# EAGLE design 555re4 (EAGLE 6.3)
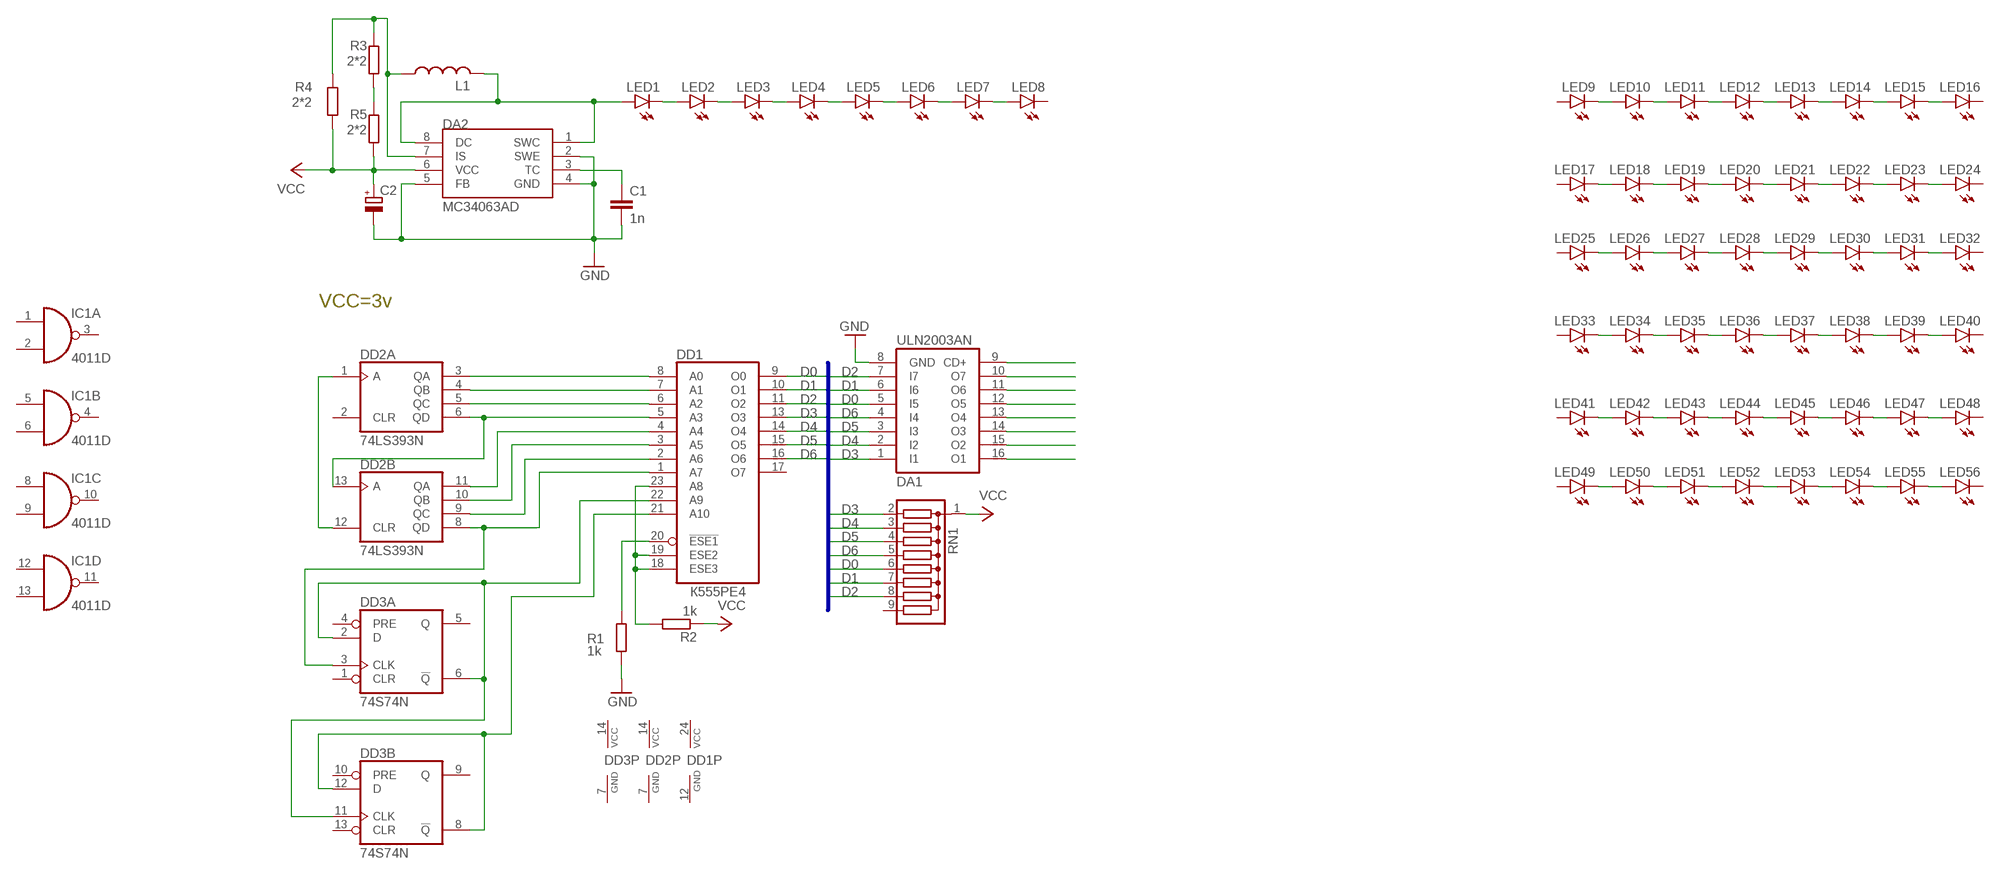
[diagram p0: schematic, sheet 1]

## Parts
C1  1n  C-EU050-025X075  [C050-025X075]
C2  CPOL-EUE2-5  [E2-5]
DA1  ULN2003AN  [DIL16]
DA2  MC34063AD  [SOIC8]
DD1  K555RE4  [239.24-2]
DD2  74LS393N  [DIL14]
DD3  74S74N  [DIL14]
IC1  4011D  [SO14]
L1  L-USTJ3-U2  [TJ3-U2]
LED1  LED3MM  [LED3MM]
LED2  LED3MM  [LED3MM]
LED3  LED3MM  [LED3MM]
LED4  LED3MM  [LED3MM]
LED5  LED3MM  [LED3MM]
LED6  LED3MM  [LED3MM]
LED7  LED3MM  [LED3MM]
LED8  LED3MM  [LED3MM]
LED9  LED3MM  [LED3MM]
LED10  LED3MM  [LED3MM]
LED11  LED3MM  [LED3MM]
LED12  LED3MM  [LED3MM]
LED13  LED3MM  [LED3MM]
LED14  LED3MM  [LED3MM]
LED15  LED3MM  [LED3MM]
LED16  LED3MM  [LED3MM]
LED17  LED3MM  [LED3MM]
LED18  LED3MM  [LED3MM]
LED19  LED3MM  [LED3MM]
LED20  LED3MM  [LED3MM]
LED21  LED3MM  [LED3MM]
LED22  LED3MM  [LED3MM]
LED23  LED3MM  [LED3MM]
LED24  LED3MM  [LED3MM]
LED25  LED3MM  [LED3MM]
LED26  LED-3MM-NO_SILK  [LED3MM-NS]
LED27  LED3MM  [LED3MM]
LED28  LED3MM  [LED3MM]
LED29  LED3MM  [LED3MM]
LED30  LED3MM  [LED3MM]
LED31  LED3MM  [LED3MM]
LED32  LED3MM  [LED3MM]
LED33  LED3MM  [LED3MM]
LED34  LED3MM  [LED3MM]
LED35  LED3MM  [LED3MM]
LED36  LED3MM  [LED3MM]
LED37  LED3MM  [LED3MM]
LED38  LED3MM  [LED3MM]
LED39  LED3MM  [LED3MM]
LED40  LED3MM  [LED3MM]
LED41  LED3MM  [LED3MM]
LED42  LED3MM  [LED3MM]
LED43  LED3MM  [LED3MM]
LED44  LED3MM  [LED3MM]
LED45  LED3MM  [LED3MM]
LED46  LED3MM  [LED3MM]
LED47  LED3MM  [LED3MM]
LED48  LED3MM  [LED3MM]
LED49  LED3MM  [LED3MM]
LED50  LED3MM  [LED3MM]
LED51  LED3MM  [LED3MM]
LED52  LED3MM  [LED3MM]
LED53  LED3MM  [LED3MM]
LED54  LED3MM  [LED3MM]
LED55  LED3MM  [LED3MM]
LED56  LED3MM  [LED3MM]
R1  1k  R-EU_0207/10  [0207/10]
R2  1k  R-EU_0207/10  [0207/10]
R3  2*2  R-EU_M0805  [M0805]
R4  2*2  R-EU_M0805  [M0805]
R5  2*2  R-EU_M0805  [M0805]
RN1  G08R  [SIL9]

## Nets
D0: DA1.5(I5) DD1.9(O0) RN1.6
D1: DA1.6(I6) DD1.10(O1) RN1.7
D2: DA1.7(I7) DD1.11(O2) RN1.8
D3: DA1.1(I1) DD1.13(O3) RN1.2
D4: DA1.2(I2) DD1.14(O4) RN1.3
D5: DA1.3(I3) DD1.15(O5) RN1.4
D6: DA1.4(I4) DD1.16(O6) RN1.5
GND: C1.2 C2.- DA1.8(GND) DA2.2(SWE) DA2.4(GND) DA2.5(FB) R1.2
N$1: DD2.1(A:A) DD2.12(B:CLR)
N$2: DD1.22(A9) DD3.2(A:D) DD3.6(A:!Q) DD3.11(B:CLK)
N$3: DD1.8(A0) DD2.3(A:QA)
N$4: DD1.7(A1) DD2.4(A:QB)
N$5: DD1.6(A2) DD2.5(A:QC)
N$6: DD1.4(A4) DD2.11(B:QA)
N$7: DD1.3(A5) DD2.10(B:QB)
N$8: DD1.2(A6) DD2.9(B:QC)
N$9: DD1.1(A7) DD2.8(B:QD) DD3.3(A:CLK)
N$10: DD1.5(A3) DD2.6(A:QD) DD2.13(B:A)
N$11: DD1.21(A10) DD3.8(B:!Q) DD3.12(B:D)
N$12: LED1.K(C) LED2.A
N$13: DA2.1(SWC) DA2.8(DC) L1.2 LED1.A
N$14: LED2.K(C) LED3.A
N$15: DA2.7(IS) L1.1 R3.2 R4.2
N$16: LED17.K(C) LED18.A
N$17: DD1.18(ESE3) DD1.19(ESE2) DD1.23(A8) R2.2
N$18: C1.1 DA2.3(TC)
N$19: DD1.20(!ESE1) R1.1
N$20: LED4.K(C) LED5.A
N$21: LED5.K(C) LED6.A
N$22: LED3.K(C) LED4.A
N$23: LED6.K(C) LED7.A
N$24: LED7.K(C) LED8.A
N$25: LED9.K(C) LED10.A
N$26: LED10.K(C) LED11.A
N$27: LED12.K(C) LED13.A
N$28: LED13.K(C) LED14.A
N$29: LED11.K(C) LED12.A
N$30: LED14.K(C) LED15.A
N$31: LED15.K(C) LED16.A
N$32: LED18.K(C) LED19.A
N$33: LED20.K(C) LED21.A
N$34: LED21.K(C) LED22.A
N$35: LED19.K(C) LED20.A
N$36: LED22.K(C) LED23.A
N$37: LED23.K(C) LED24.A
N$38: LED25.K(C) LED26.A
N$39: LED26.K(C) LED27.A
N$40: LED28.K(C) LED29.A
N$41: LED29.K(C) LED30.A
N$42: LED27.K(C) LED28.A
N$43: LED30.K(C) LED31.A
N$44: LED31.K(C) LED32.A
N$45: LED33.K(C) LED34.A
N$46: LED34.K(C) LED35.A
N$47: LED36.K(C) LED37.A
N$48: LED37.K(C) LED38.A
N$49: LED35.K(C) LED36.A
N$50: LED38.K(C) LED39.A
N$51: LED39.K(C) LED40.A
N$52: LED41.K(C) LED42.A
N$53: LED42.K(C) LED43.A
N$54: LED44.K(C) LED45.A
N$55: LED45.K(C) LED46.A
N$56: LED43.K(C) LED44.A
N$57: LED46.K(C) LED47.A
N$58: LED47.K(C) LED48.A
N$59: LED49.K(C) LED50.A
N$60: LED50.K(C) LED51.A
N$61: LED52.K(C) LED53.A
N$62: LED53.K(C) LED54.A
N$63: LED51.K(C) LED52.A
N$64: LED54.K(C) LED55.A
N$65: LED55.K(C) LED56.A
N$66: R3.1 R5.2
N$67: DA1.9(CD+)
N$68: DA1.10(O7)
N$69: DA1.11(O6)
N$70: DA1.12(O5)
N$71: DA1.13(O4)
N$72: DA1.14(O3)
N$73: DA1.15(O2)
N$74: DA1.16(O1)
VCC: C2.+ DA2.6(VCC) R2.1 R4.1 R5.1 RN1.1
Unconnected: DD1.17(O7) DD2.2(A:CLR) DD3.1(A:CLR) DD3.4(A:PRE) DD3.5(A:Q) DD3.9(B:Q) DD3.10(B:PRE) DD3.13(B:CLR) IC1.1(A:I0) IC1.2(A:I1) IC1.3(A:O) IC1.4(B:O) IC1.5(B:I0) IC1.6(B:I1) IC1.8(C:I0) IC1.9(C:I1) IC1.10(C:O) IC1.11(D:O) IC1.12(D:I0) IC1.13(D:I1) LED8.K(C) LED9.A LED16.K(C) LED17.A LED24.K(C) LED25.A LED32.K(C) LED33.A LED40.K(C) LED41.A LED48.K(C) LED49.A LED56.K(C) RN1.9

## Buses
D[0..7]

## Notes on the sheet
- VCC=3v

## Power pins joined to a net without a drawn wire
GND: DD1.12(GND) DD2.7(P:GND) DD3.7(P:GND)
VCC: DD1.24(VCC) DD2.14(P:VCC) DD3.14(P:VCC)
VDD: IC1.14(P:VDD)
VSS: IC1.7(P:VSS)

## Library data of the parts
C1 = rcl:C-EU: CAPACITOR, European symbol
C2 = rcl:CPOL-EU: POLARIZED CAPACITOR, European symbol
DA1 = uln-udn:ULN2003A: DRIVER ARRAY
DA2 = mc34063:MC34063
DD1 = Советские ПЗУ:K555RE4: ROM 2Кх8 КОИ-8 по ГОСТ 19768-74 ПЗУ знакогенератор символов 7х11 точек. Uпит. 5В 5%, Iпот. 175мА, P 892,5мВт U0вх. 0.5в, I0вх. 250мкА, I1вх. 25мкА, I1вых. 100мкА tвыб. 40нс, tвА 110нс. Uвых. закр.МС при 5мс = 5,25в. Снагр.макс. = 200пФ tокруж. = -10..+70 С Содержит 20 000 интегральных элементов, масса не болеее 6 г. Нефедов А.В. Интегральные микросхемы и их зарубежные аналоги К544-К564 Том 5
DD2 = 74xx-eu:74*393: Dual 4-bit decade and binary COUNTER
DD3 = 74xx-eu:74*74: Dual D type positive edge triggered FLIP FLOP, preset and clear
IC1 = 40xx:4011: Quad 2-input NAND
L1 = rcl:L-US: INDUCTOR, American symbol
LED1-LED56 = SparkFun-LED:LED: LEDs Standard schematic elements and footprints for 5mm, 3mm, 1206, and 0603 sized LEDs. 5mm - Spark Fun Electronics SKU : COM-00529 (and others)
R1-R5 = rcl:R-EU_: RESISTOR, European symbol
RN1 = resistor-sil:G08R: SIL RESISTOR; OC_FARNELL: unknown; OC_NEWARK: unknown

## Board
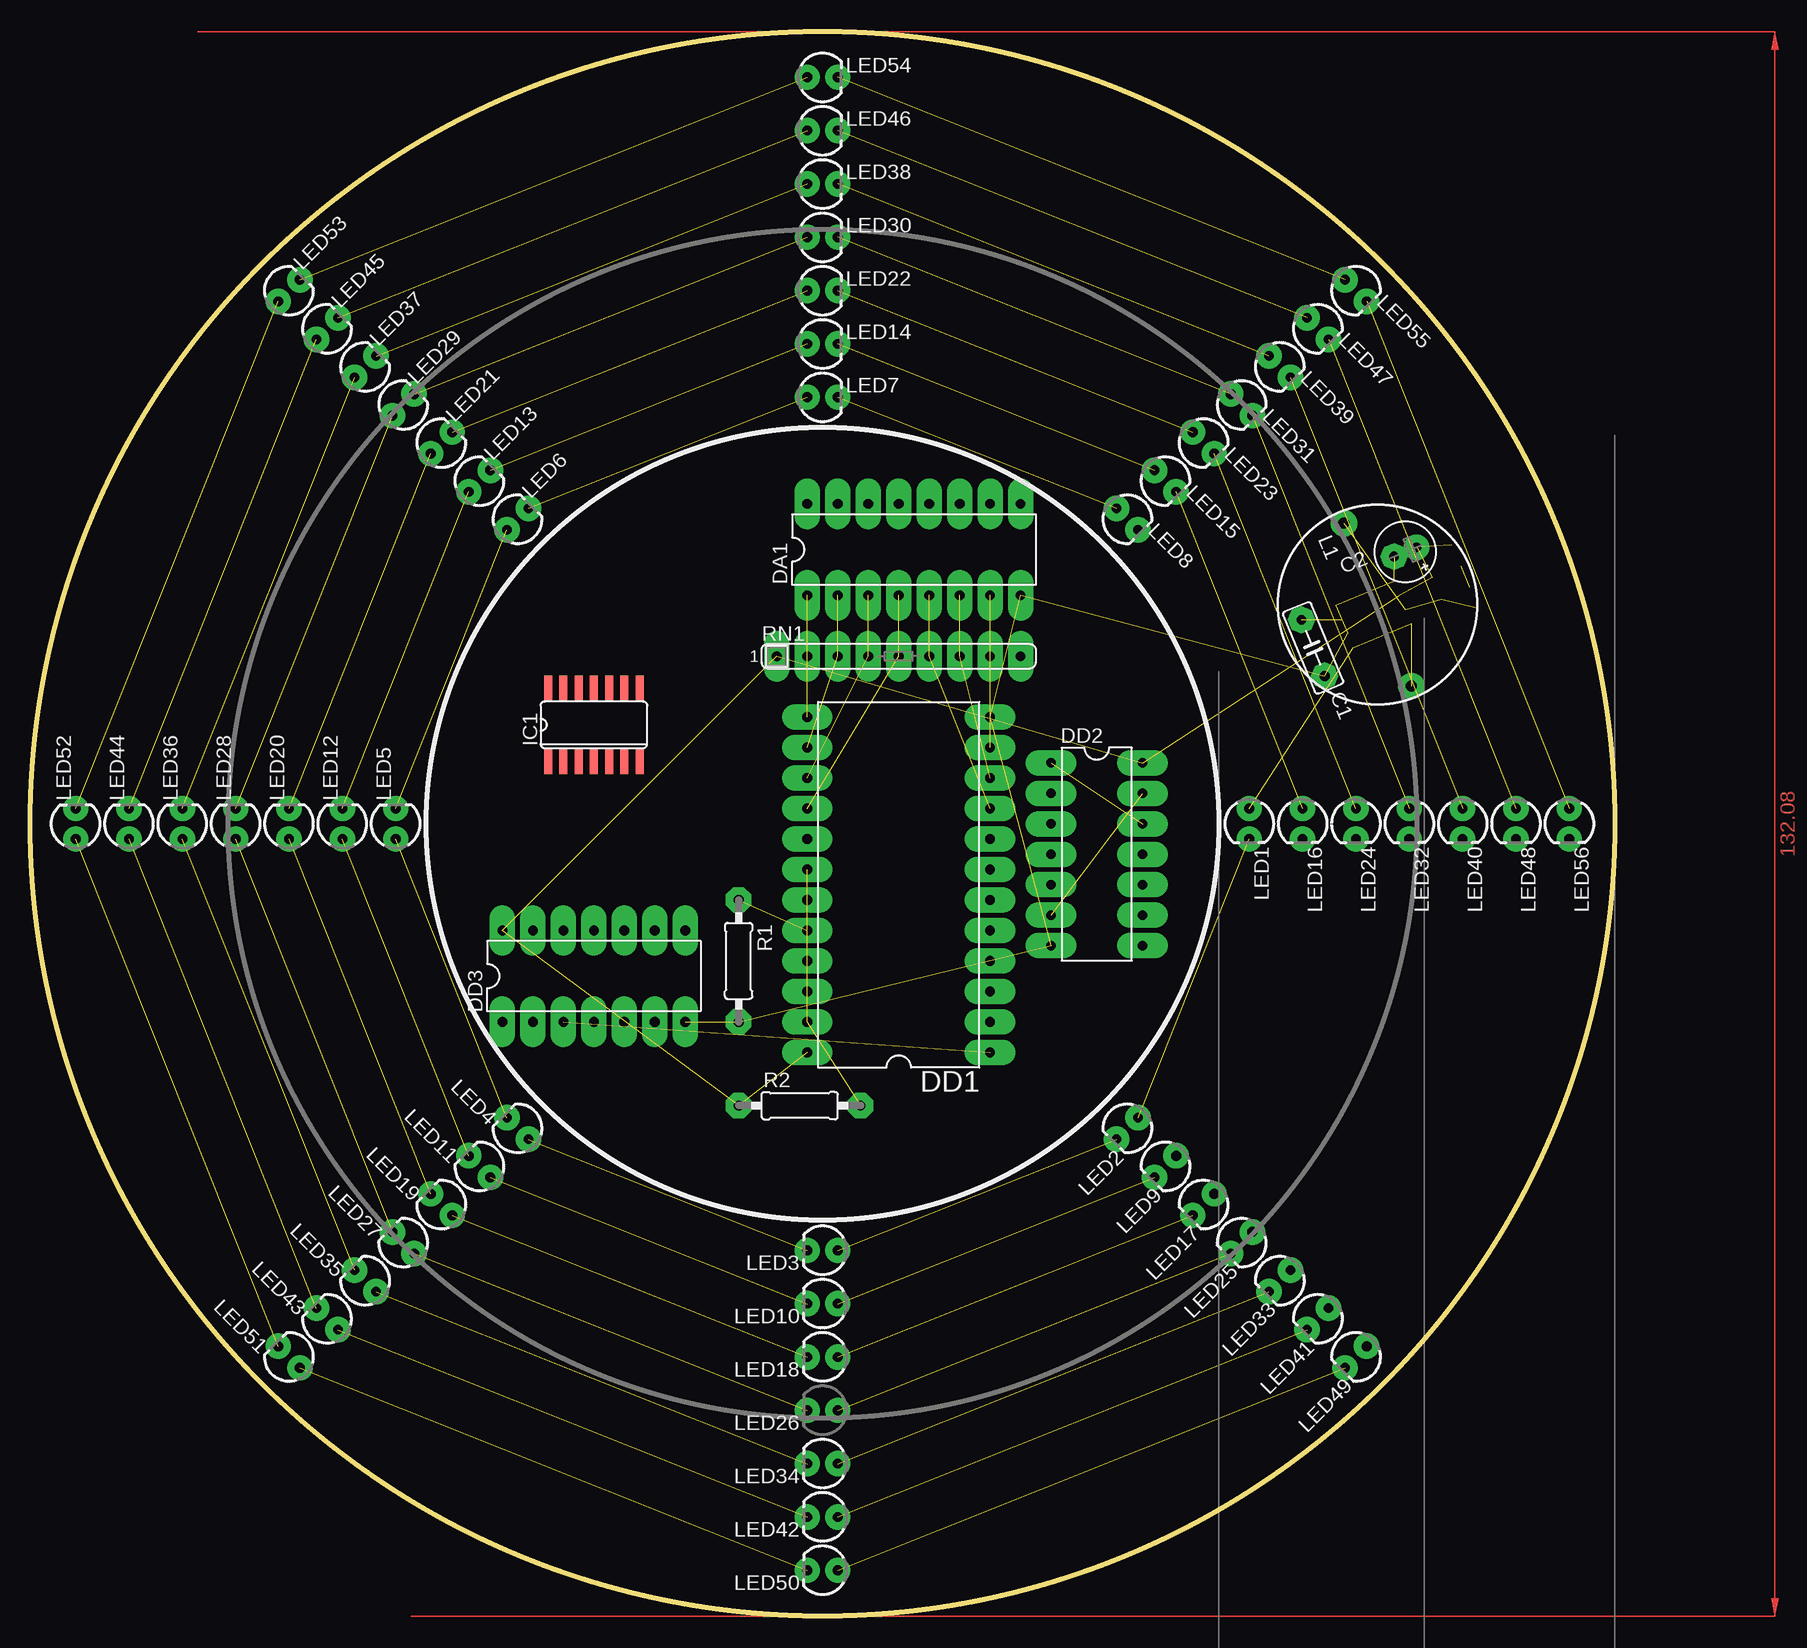
[diagram p1: board, top side]
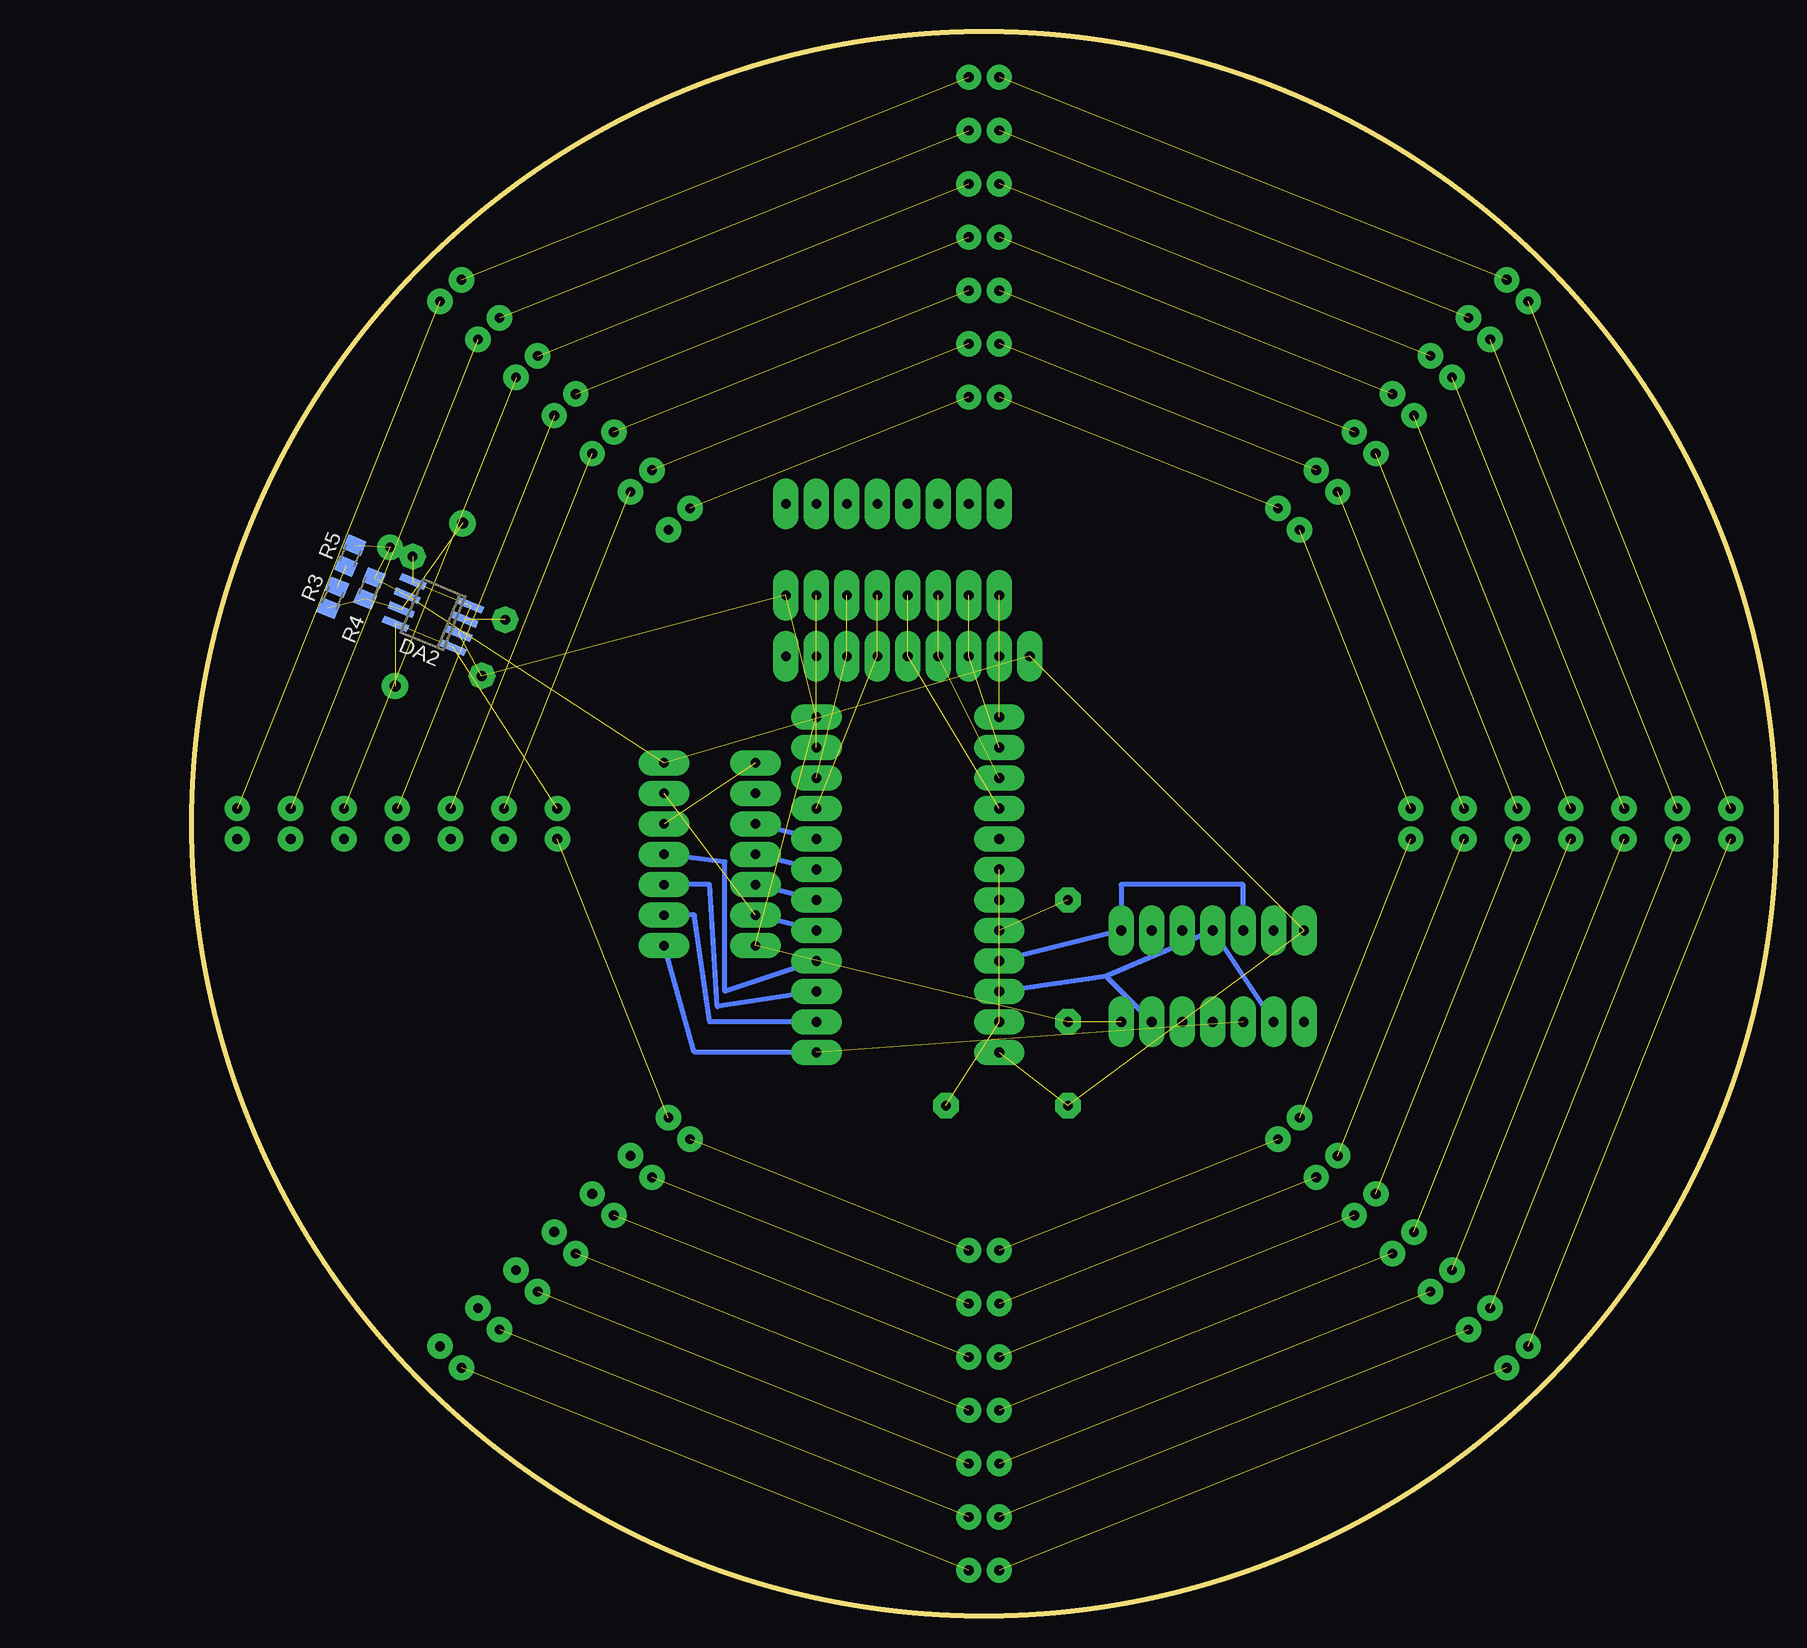
[diagram p2: board, bottom side, seen from below]

Size 132.08 x 132.08 mm. Coordinates in mm from the lower left corner, seen from the top.
Outline: circle at 66.04,66.04 radius 66.04
Copper layers (1*16): Top 0.035mm / dielectric 1.5mm / Bottom 0.035mm
Design rules "DesignRules": minimum track width 8mil, minimum drill 24mil, track to track 0.2mm, track to pad 0.2mm, pad to pad 8mil, via to via 8mil, smd to smd 8mil, copper to edge 10mil, drill to drill 8mil, minimum pad ring 0.65mm, minimum via ring 8mil, stop-mask expansion 4mil, vias tented up to drill 0mil, thermal gap 10mil

### Footprints (pad centres in the part's own frame; a part is rotated, then mirrored left to right if it is on the bottom)
C050-025X075 = drill 0.813 octagon: 1 -2.54,0; 2 2.54,0
E2-5 = drill 0.813 pad 1.27: + -1.016,0 | drill 0.813 pad 1.27 octagon: - 1.016,0
DIL16 = drill 0.813 long: 1 -8.89,-3.81; 2 -6.35,-3.81; 3 -3.81,-3.81; 4 -1.27,-3.81; 5 1.27,-3.81; 6 3.81,-3.81; 7 6.35,-3.81; 8 8.89,-3.81; 9 8.89,3.81; 10 6.35,3.81; 11 3.81,3.81; 12 1.27,3.81; 13 -1.27,3.81; 14 -3.81,3.81; 15 -6.35,3.81; 16 -8.89,3.81
SOIC8 = smd 0.6 x 2.2: 1 -1.905,-2.6; 2 -0.635,-2.6; 3 0.635,-2.6; 4 1.905,-2.6; 5 1.905,2.6; 6 0.635,2.6; 7 -0.635,2.6; 8 -1.905,2.6
239.24-2 = drill 0.813 long: 1 -13.97,-7.62; 2 -11.43,-7.62; 3 -8.89,-7.62; 4 -6.35,-7.62; 5 -3.81,-7.62; 6 -1.27,-7.62; 7 1.27,-7.62; 8 3.81,-7.62; 9 6.35,-7.62; 10 8.89,-7.62; 11 11.43,-7.62; 12 13.97,-7.62; 13 13.97,7.62; 14 11.43,7.62; 15 8.89,7.62; 16 6.35,7.62; 17 3.81,7.62; 18 1.27,7.62; 19 -1.27,7.62; 20 -3.81,7.62; 21 -6.35,7.62; 22 -8.89,7.62; 23 -11.43,7.62; 24 -13.97,7.62
DIL14 = drill 0.813 long: 1 -7.62,-3.81; 2 -5.08,-3.81; 3 -2.54,-3.81; 4 0,-3.81; 5 2.54,-3.81; 6 5.08,-3.81; 7 7.62,-3.81; 8 7.62,3.81; 9 5.08,3.81; 10 2.54,3.81; 11 0,3.81; 12 -2.54,3.81; 13 -5.08,3.81; 14 -7.62,3.81
SO14 = smd 0.66 x 2.032: 1 -3.81,-3.073; 2 -2.54,-3.073; 3 -1.27,-3.073; 4 0,-3.073; 5 1.27,-3.073; 6 2.54,-3.073; 7 3.81,-3.073; 8 3.81,3.073; 9 2.54,3.073; 10 1.27,3.073; 11 0,3.073; 12 -1.27,3.073; 13 -2.54,3.073; 14 -3.81,3.073
TJ3-U2 = drill 0.9: 1 -7.35,0; 2 7.35,0
LED3MM = drill 0.813 pad 1.88: A -1.27,0; K 1.27,0
LED3MM-NS = drill 0.813: A -1.27,0; K 1.27,0
0207/10 = drill 0.813 octagon: 1 -5.08,0; 2 5.08,0
M0805 = smd 1.3 x 1.6: 1 -0.95,0; 2 0.95,0
SIL9 = drill 0.813 long: 1 -10.16,0; 2 -7.62,0; 3 -5.08,0; 4 -2.54,0; 5 0,0; 6 2.54,0; 7 5.08,0; 8 7.62,0; 9 10.16,0

### Placement (x,y rotation side)
C1  106.92,80.71 292.5 top
C2  114.61,88.7 202.5 top
DA1  73.66,88.9 0 top
DA2  111.96,83.48 67.5 bottom
DD1  72.39,60.96 90 top
DD2  88.9,63.5 270 top
DD3  46.99,53.34 0 top
IC1  46.99,74.3 0 top
L1  112.3,84.31 292.5 top
LED1  101.6,66.04 270 top
LED2  91.44,40.64 225 top
LED3  66.04,30.48 180 top
LED4  40.64,40.64 135 top
LED5  30.48,66.04 90 top
LED6  40.64,91.44 45 top
LED7  66.04,101.6 0 top
LED8  91.44,91.44 315 top
LED9  94.62,37.47 225 top
LED10  66.04,26.04 180 top
LED11  37.47,37.47 135 top
LED12  26.04,66.04 90 top
LED13  37.47,94.62 45 top
LED14  66.04,106.05 0 top
LED15  94.62,94.62 315 top
LED16  106.05,66.04 270 top
LED17  97.79,34.29 225 top
LED18  66.04,21.59 180 top
LED19  34.29,34.29 135 top
LED20  21.59,66.04 90 top
LED21  34.29,97.79 45 top
LED22  66.04,110.49 0 top
LED23  97.79,97.79 315 top
LED24  110.49,66.04 270 top
LED25  100.97,31.12 225 top
LED26  66.04,17.15 180 top
LED27  31.12,31.12 135 top
LED28  17.15,66.04 90 top
LED29  31.12,100.97 45 top
LED30  66.04,114.94 0 top
LED31  100.97,100.97 315 top
LED32  114.94,66.04 270 top
LED33  104.14,27.94 225 top
LED34  66.04,12.7 180 top
LED35  27.94,27.94 135 top
LED36  12.7,66.04 90 top
LED37  27.94,104.14 45 top
LED38  66.04,119.38 0 top
LED39  104.14,104.14 315 top
LED40  119.38,66.04 270 top
LED41  107.32,24.77 225 top
LED42  66.04,8.26 180 top
LED43  24.77,24.77 135 top
LED44  8.26,66.04 90 top
LED45  24.77,107.32 45 top
LED46  66.04,123.83 0 top
LED47  107.32,107.32 315 top
LED48  123.83,66.04 270 top
LED49  110.49,21.59 225 top
LED50  66.04,3.81 180 top
LED51  21.59,21.59 135 top
LED52  3.81,66.04 90 top
LED53  21.59,110.49 45 top
LED54  66.04,128.27 0 top
LED55  110.49,110.49 315 top
LED56  128.27,66.04 270 top
R1  59.06,54.61 270 top
R2  64.14,42.55 0 top
R3  120.31,84.88 247.5 bottom
R4  117.24,85.67 247.5 bottom
R5  118.85,88.4 247.5 bottom
RN1  72.39,80.01 0 top

### Tracks (layer width: path | path; a pad name or v marks a point on that pad's centre or on a via)
D0  (2 unrouted)
D1  (2 unrouted)
D2  (2 unrouted)
D3  (2 unrouted)
D4  (2 unrouted)
D5  (2 unrouted)
D6  (2 unrouted)
GND  (9 unrouted)
N$1  (1 unrouted)
N$2
  Bottom 0.406: DD1.22 55.88,53.34 | 55.88,53.34 DD3.6 | DD3.2 DD3.11 55.88,53.34
N$3
  Bottom 0.406: DD1.8 DD2.3
N$4
  Bottom 0.406: DD1.7 DD2.4
N$5
  Bottom 0.406: DD1.6 DD2.5
N$6
  Bottom 0.406: DD1.4 87.63,52.07 87.63,62.87 DD2.11
N$7
  Bottom 0.406: DD1.3 88.27,50.8 88.9,60.96 DD2.10
N$8
  Bottom 0.406: DD1.2 88.9,49.53 90.17,58.42 DD2.9
N$9  (1 unrouted)
  Bottom 0.406: DD1.1 90.17,46.99 DD2.8
N$10  (1 unrouted)
  Bottom 0.406: DD1.5 DD2.6
N$11
  Bottom 0.406: DD3.12 44.45,60.96 54.61,60.96 DD3.8 DD1.21
N$12  (1 unrouted)
N$13  (3 unrouted)
N$14  (1 unrouted)
N$15  (3 unrouted)
N$16  (1 unrouted)
N$17  (3 unrouted)
N$18  (1 unrouted)
N$19  (1 unrouted)
N$20  (1 unrouted)
N$21  (1 unrouted)
N$22  (1 unrouted)
N$23  (1 unrouted)
N$24  (1 unrouted)
N$25  (1 unrouted)
N$26  (1 unrouted)
N$27  (1 unrouted)
N$28  (1 unrouted)
N$29  (1 unrouted)
N$30  (1 unrouted)
N$31  (1 unrouted)
N$32  (1 unrouted)
N$33  (1 unrouted)
N$34  (1 unrouted)
N$35  (1 unrouted)
N$36  (1 unrouted)
N$37  (1 unrouted)
N$38  (1 unrouted)
N$39  (1 unrouted)
N$40  (1 unrouted)
N$41  (1 unrouted)
N$42  (1 unrouted)
N$43  (1 unrouted)
N$44  (1 unrouted)
N$45  (1 unrouted)
N$46  (1 unrouted)
N$47  (1 unrouted)
N$48  (1 unrouted)
N$49  (1 unrouted)
N$50  (1 unrouted)
N$51  (1 unrouted)
N$52  (1 unrouted)
N$53  (1 unrouted)
N$54  (1 unrouted)
N$55  (1 unrouted)
N$56  (1 unrouted)
N$57  (1 unrouted)
N$58  (1 unrouted)
N$59  (1 unrouted)
N$60  (1 unrouted)
N$61  (1 unrouted)
N$62  (1 unrouted)
N$63  (1 unrouted)
N$64  (1 unrouted)
N$65  (1 unrouted)
N$66  (1 unrouted)
VCC  (8 unrouted)
(copper drawn outside any net)
  shapes: Top area x2